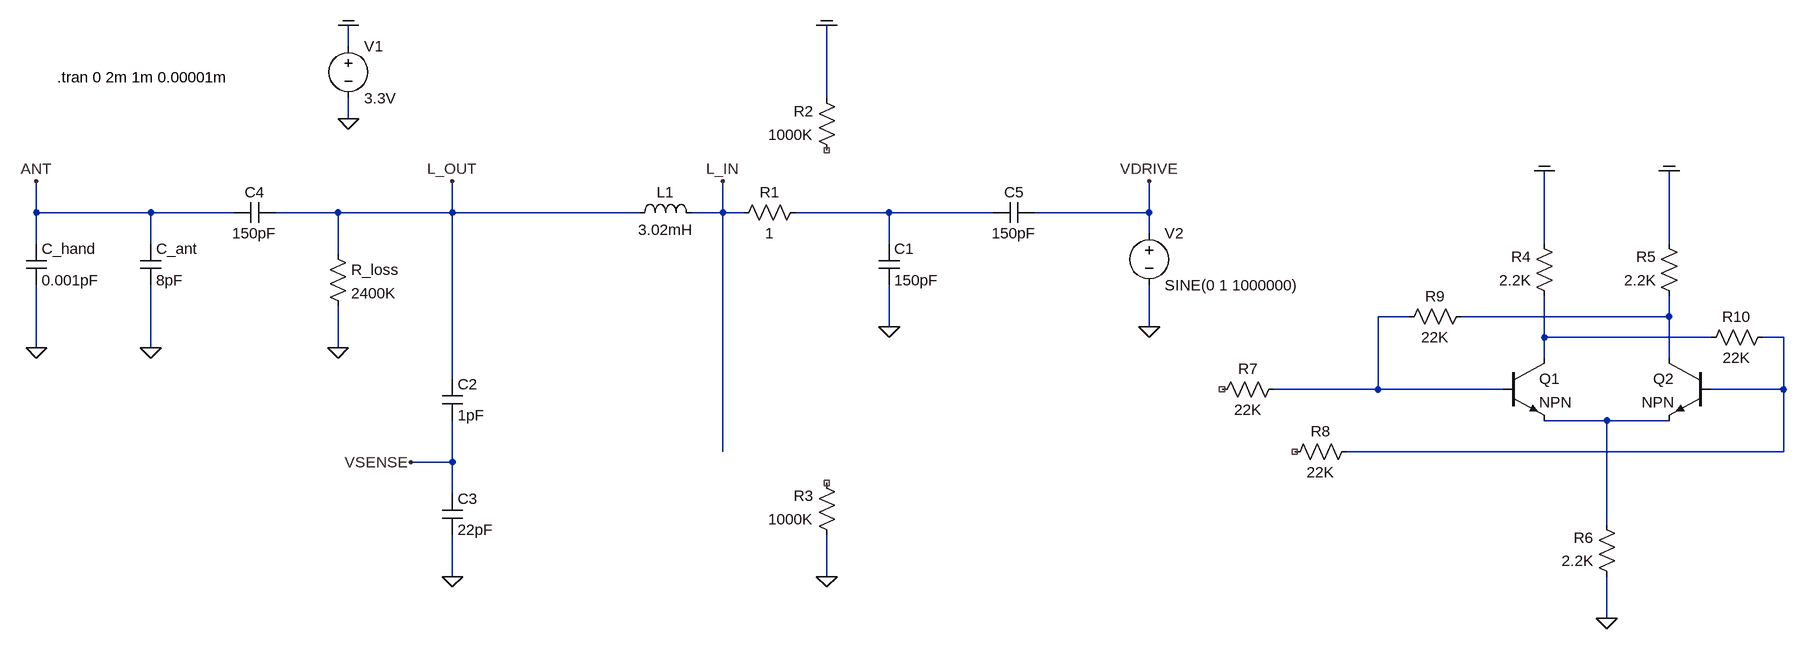
[diagram p0: schematic 2020_oscillator_experiments_v1.asc]
2020_oscillator_experiments_v1.asc, the LTspice schematic file:
Version 4
SHEET 1 2452 980
WIRE 0 80 0 48
WIRE 736 160 736 48
WIRE 0 192 0 160
WIRE -480 336 -480 288
WIRE -304 336 -480 336
WIRE -176 336 -304 336
WIRE -16 336 -112 336
WIRE 160 336 160 288
WIRE 160 336 -16 336
WIRE 448 336 160 336
WIRE 576 336 576 288
WIRE 576 336 528 336
WIRE 608 336 576 336
WIRE 832 336 688 336
WIRE 992 336 832 336
WIRE 1232 336 1232 288
WIRE 1232 336 1056 336
WIRE 1232 368 1232 336
WIRE -480 384 -480 336
WIRE -304 384 -304 336
WIRE 832 384 832 336
WIRE 1840 384 1840 272
WIRE 2032 384 2032 272
WIRE -16 400 -16 336
WIRE 1632 496 1584 496
WIRE 2032 496 2032 464
WIRE 2032 496 1712 496
WIRE 832 512 832 448
WIRE 1232 512 1232 448
WIRE 1840 528 1840 464
WIRE 2096 528 1840 528
WIRE 2208 528 2176 528
WIRE -480 544 -480 448
WIRE -304 544 -304 448
WIRE -16 544 -16 480
WIRE 1840 560 1840 528
WIRE 2032 560 2032 496
WIRE 160 592 160 336
WIRE 1584 608 1584 496
WIRE 1584 608 1424 608
WIRE 1776 608 1584 608
WIRE 2208 608 2208 528
WIRE 2208 608 2096 608
WIRE 1936 656 1840 656
WIRE 2032 656 1936 656
WIRE 576 704 576 336
WIRE 2208 704 2208 608
WIRE 2208 704 1536 704
WIRE 160 720 160 656
WIRE 160 720 96 720
WIRE 160 768 160 720
WIRE 1936 816 1936 656
WIRE 160 896 160 832
WIRE 736 896 736 832
WIRE 1936 960 1936 896
FLAG 0 192 0
FLAG 0 48 COM
FLAG -480 288 ANT
FLAG -480 544 0
FLAG -304 544 0
FLAG 832 512 0
FLAG 160 896 0
FLAG -16 544 0
FLAG 1232 512 0
FLAG 1232 288 VDRIVE
FLAG 96 720 VSENSE
FLAG 736 896 0
FLAG 736 48 COM
FLAG 1840 272 COM
FLAG 2032 272 COM
FLAG 1936 960 0
FLAG 576 288 L_IN
FLAG 160 288 L_OUT
SYMBOL voltage 0 64 R0
WINDOW 123 0 0 Left 0
WINDOW 39 0 0 Left 0
SYMATTR InstName V1
SYMATTR Value 3.3V
SYMBOL ind 432 352 R270
WINDOW 0 32 56 VTop 2
WINDOW 3 5 56 VBottom 2
SYMATTR InstName L1
SYMATTR Value 3.02mH
SYMATTR SpiceLine Rser=120
SYMBOL cap 816 384 R0
SYMATTR InstName C1
SYMATTR Value 150pF
SYMBOL cap 144 592 R0
SYMATTR InstName C2
SYMATTR Value 1pF
SYMBOL cap 144 768 R0
SYMATTR InstName C3
SYMATTR Value 22pF
SYMBOL cap -320 384 R0
SYMATTR InstName C_ant
SYMATTR Value 8pF
SYMBOL cap -496 384 R0
SYMATTR InstName C_hand
SYMATTR Value 0.001pF
SYMBOL cap -112 320 R90
WINDOW 0 0 32 VBottom 2
WINDOW 3 32 32 VTop 2
SYMATTR InstName C4
SYMATTR Value 150pF
SYMBOL res -32 384 R0
SYMATTR InstName R_loss
SYMATTR Value 2400K
SYMBOL voltage 1232 352 R0
WINDOW 123 0 0 Left 0
WINDOW 39 0 0 Left 0
SYMATTR InstName V2
SYMATTR Value SINE(0 1 1000000)
SYMBOL cap 1056 320 R90
WINDOW 0 0 32 VBottom 2
WINDOW 3 32 32 VTop 2
SYMATTR InstName C5
SYMATTR Value 150pF
SYMBOL res 704 320 R90
WINDOW 0 0 56 VBottom 2
WINDOW 3 32 56 VTop 2
SYMATTR InstName R1
SYMATTR Value 1
SYMBOL res 752 256 R180
WINDOW 0 36 76 Left 2
WINDOW 3 36 40 Left 2
SYMATTR InstName R2
SYMATTR Value 1000K
SYMBOL res 752 848 R180
WINDOW 0 36 76 Left 2
WINDOW 3 36 40 Left 2
SYMATTR InstName R3
SYMATTR Value 1000K
SYMBOL npn 1776 560 R0
SYMATTR InstName Q1
SYMBOL npn 2096 560 M0
SYMATTR InstName Q2
SYMBOL res 1856 480 R180
WINDOW 0 36 76 Left 2
WINDOW 3 36 40 Left 2
SYMATTR InstName R4
SYMATTR Value 2.2K
SYMBOL res 2048 480 R180
WINDOW 0 36 76 Left 2
WINDOW 3 36 40 Left 2
SYMATTR InstName R5
SYMATTR Value 2.2K
SYMBOL res 1952 912 R180
WINDOW 0 36 76 Left 2
WINDOW 3 36 40 Left 2
SYMATTR InstName R6
SYMATTR Value 2.2K
SYMBOL res 1440 592 R90
WINDOW 0 0 56 VBottom 2
WINDOW 3 32 56 VTop 2
SYMATTR InstName R7
SYMATTR Value 22K
SYMBOL res 1552 688 R90
WINDOW 0 0 56 VBottom 2
WINDOW 3 32 56 VTop 2
SYMATTR InstName R8
SYMATTR Value 22K
SYMBOL res 1728 480 R90
WINDOW 0 0 56 VBottom 2
WINDOW 3 32 56 VTop 2
SYMATTR InstName R9
SYMATTR Value 22K
SYMBOL res 2192 512 R90
WINDOW 0 0 56 VBottom 2
WINDOW 3 32 56 VTop 2
SYMATTR InstName R10
SYMATTR Value 22K
TEXT -448 128 Left 2 !.tran 0 2m 1m 0.00001m

The netlist it stands for:
* 2020_oscillator_experiments_v1.asc
V1 COM 0 3.3V
L1 L_OUT L_IN 3.02mH Rser=120
C1 N001 0 150pF
C2 L_OUT VSENSE 1pF
C3 VSENSE 0 22pF
C_ant ANT 0 8pF
C_hand ANT 0 0.001pF
C4 L_OUT ANT 150pF
R_loss L_OUT 0 2400K
V2 VDRIVE 0 SINE(0 1 1000000)
C5 VDRIVE N001 150pF
R1 N001 L_IN 1
R2 NC_01 COM 1000K
R3 0 NC_02 1000K
Q1 N004 N002 N006 0 NPN
Q2 N003 N005 N006 0 NPN
R4 N004 COM 2.2K
R5 N003 COM 2.2K
R6 0 N006 2.2K
R7 N002 NC_03 22K
R8 N005 NC_04 22K
R9 N003 N002 22K
R10 N005 N004 22K
.model NPN NPN
.model PNP PNP
.lib standard.bjt
.tran 0 2m 1m 0.00001m
.backanno
.end